# Altium schematic sheet FPGA_165B_StopWatch.SchDoc: LiveDesign Evaluation - Stop Watch
size A3; Organization: Altium Limited; Address1: L3, 12a Rodborough Rd; Address2: Frenchs Forest; Address3: NSW; Address4: Australia 2086; DocumentNumber: 1; SheetNumber: 1; SheetTotal: 7
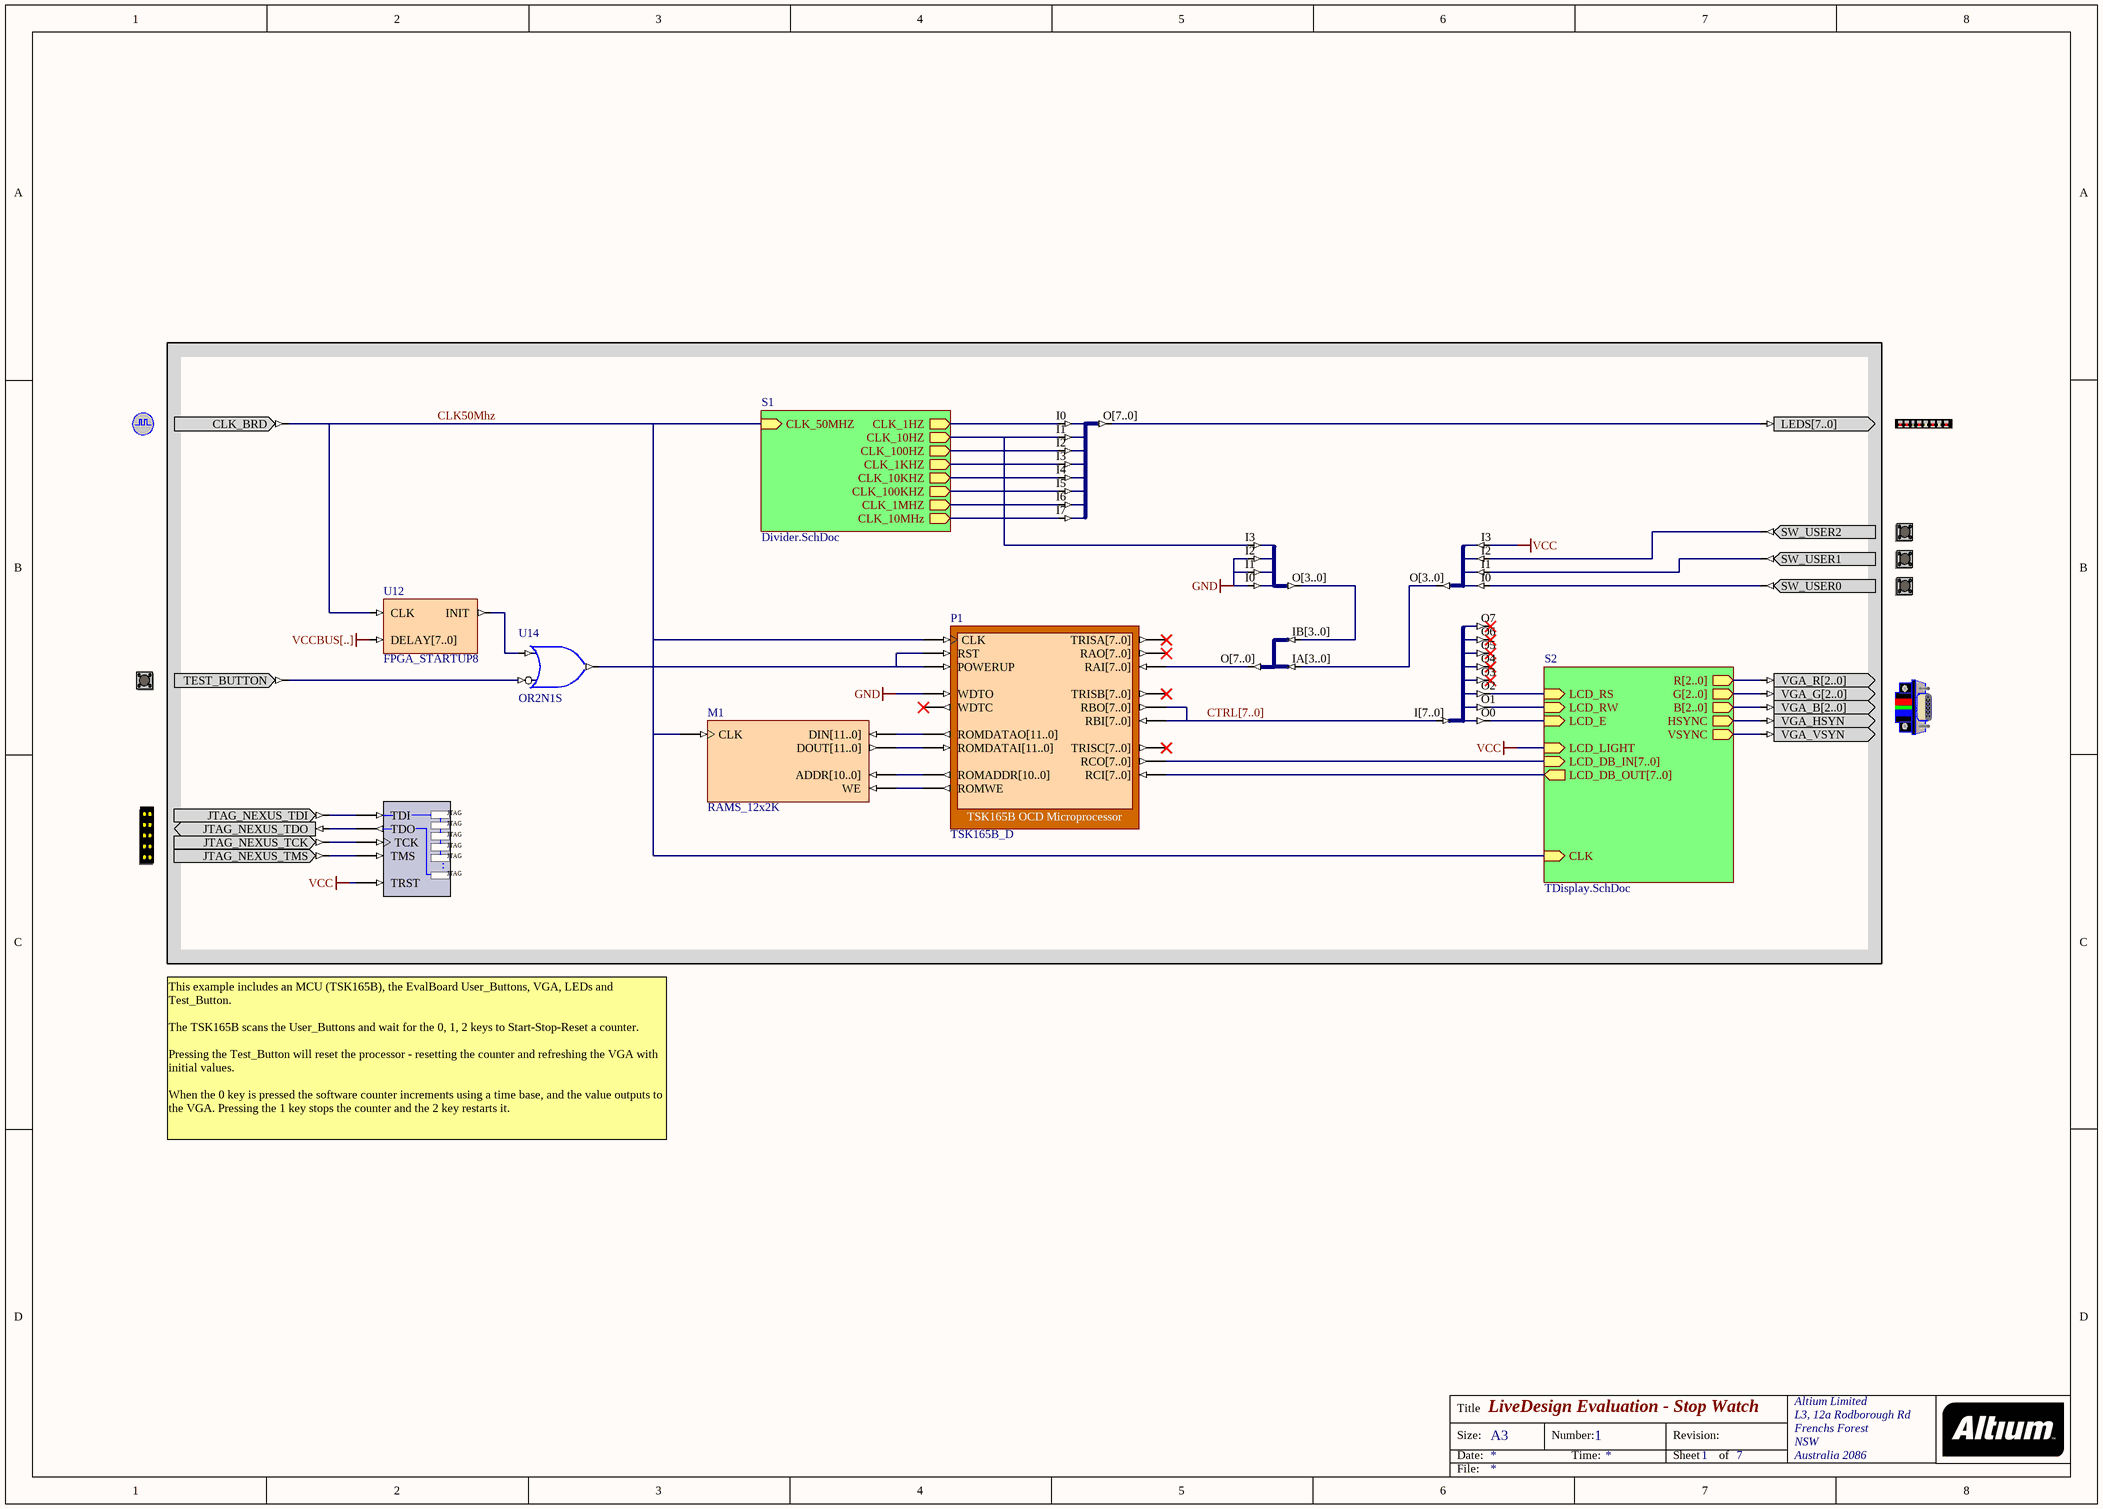
[diagram p0: FPGA_165B_StopWatch.SchDoc]

## Parts
CLOCK_BOARD  CLOCK_BOARD  (value not drawn)
LED  LED  (value not drawn)
M1  RAMS_12x2K
NEXUS_JTAG_CONNECTOR  NEXUS_JTAG_CONNECTOR  (value not drawn)
NEXUS_JTAG_PORT  NEXUS_JTAG_PORT  (value not drawn)
P1  TSK165B_D
TEST_BUTTON  TEST_BUTTON  (value not drawn)
U9  J8S_8B  (value not drawn)
U10  J4S_4B  (value not drawn)
U11  J4S_4B  (value not drawn)
U12  FPGA_STARTUP8
U13  J8B_8S  (value not drawn)
U14  OR2N1S
U15  J4B2_8B  (value not drawn)
USER_BUTTON0  USER_BUTTON0  (value not drawn)
USER_BUTTON1  USER_BUTTON1  (value not drawn)
USER_BUTTON2  USER_BUTTON2  (value not drawn)
VGACNTR  VGACNTR  (value not drawn)

## Sub-sheets
S1 = Divider.SchDoc: CLK_50MHZ (in), CLK_10HZ (out), CLK_100HZ (out), CLK_1KHZ (out), CLK_10KHZ (out), CLK_100KHZ (out), CLK_1MHZ (out), CLK_1HZ (out), CLK_10MHz (out)
S2 = TDisplay.SchDoc: CLK (in), HSYNC (out), VSYNC (out), R[2..0] (out), G[2..0] (out), B[2..0] (out), LCD_LIGHT (in), LCD_E (in), LCD_RW (in), LCD_RS (in), LCD_DB_IN[7..0] (in), LCD_DB_OUT[7..0] (out)

## Nets
GND: P1.WDTO U11.I0 U11.I1 U11.I2
VCC: NEXUS_JTAG_PORT.TRST U10.I3 ; sheet S2/LCD_LIGHT
VCCBUS[..]: U12.DELAY[7..0]
CLK50Mhz: CLOCK_BOARD.CLK_BRD M1.CLK P1.CLK U12.CLK ; sheet S1/CLK_50MHZ, sheet S2/CLK
CTRL[7..0]: P1.RBI[7..0] P1.RBO[7..0] U13.I[7..0]
NetLED_LEDS[7..0]: LED.LEDS[7..0] U9.O[7..0]
NetM1_ADDR[10..0]: M1.ADDR[10..0] P1.ROMADDR[10..0]
NetM1_DIN[11..0]: M1.DIN[11..0] P1.ROMDATAO[11..0]
NetM1_DOUT[11..0]: M1.DOUT[11..0] P1.ROMDATAI[11..0]
NetM1_WE: M1.WE P1.ROMWE
NetNEXUS_JTAG_CONNECTOR_JTAG_NEXUS_TCK: NEXUS_JTAG_CONNECTOR.JTAG_NEXUS_TCK NEXUS_JTAG_PORT.TCK
NetNEXUS_JTAG_CONNECTOR_JTAG_NEXUS_TDI: NEXUS_JTAG_CONNECTOR.JTAG_NEXUS_TDI NEXUS_JTAG_PORT.TDI
NetNEXUS_JTAG_CONNECTOR_JTAG_NEXUS_TDO: NEXUS_JTAG_CONNECTOR.JTAG_NEXUS_TDO NEXUS_JTAG_PORT.TDO
NetNEXUS_JTAG_CONNECTOR_JTAG_NEXUS_TMS: NEXUS_JTAG_CONNECTOR.JTAG_NEXUS_TMS NEXUS_JTAG_PORT.TMS
NetP1_POWERUP: P1.POWERUP P1.RST U14.O
NetP1_RAI[7..0]: P1.RAI[7..0] U15.O[7..0]
NetP1_RCI[7..0]: P1.RCI[7..0] ; sheet S2/LCD_DB_OUT[7..0]
NetP1_RCO[7..0]: P1.RCO[7..0] ; sheet S2/LCD_DB_IN[7..0]
NetTEST_BUTTON_TEST_BUTTON: TEST_BUTTON.TEST_BUTTON U14.I0
NetU9_I0: U9.I0 ; sheet S1/CLK_1HZ
NetU9_I1: U9.I1 U11.I3 ; sheet S1/CLK_10HZ
NetU9_I2: U9.I2 ; sheet S1/CLK_100HZ
NetU9_I3: U9.I3 ; sheet S1/CLK_1KHZ
NetU9_I4: U9.I4 ; sheet S1/CLK_10KHZ
NetU9_I5: U9.I5 ; sheet S1/CLK_100KHZ
NetU9_I6: U9.I6 ; sheet S1/CLK_1MHZ
NetU9_I7: U9.I7 ; sheet S1/CLK_10MHz
NetU10_I0: U10.I0 USER_BUTTON0.SW_USER0
NetU10_I1: U10.I1 USER_BUTTON1.SW_USER1
NetU10_I2: U10.I2 USER_BUTTON2.SW_USER2
NetU10_O[3..0]: U10.O[3..0] U15.IA[3..0]
NetU11_O[3..0]: U11.O[3..0] U15.IB[3..0]
NetU12_INIT: U12.INIT U14.I1
NetU13_O0: U13.O0 ; sheet S2/LCD_E
NetU13_O1: U13.O1 ; sheet S2/LCD_RW
NetU13_O2: U13.O2 ; sheet S2/LCD_RS
NetVGACNTR_VGA_B[2..0]: VGACNTR.VGA_B[2..0] ; sheet S2/B[2..0]
NetVGACNTR_VGA_G[2..0]: VGACNTR.VGA_G[2..0] ; sheet S2/G[2..0]
NetVGACNTR_VGA_HSYN: VGACNTR.VGA_HSYN ; sheet S2/HSYNC
NetVGACNTR_VGA_R[2..0]: VGACNTR.VGA_R[2..0] ; sheet S2/R[2..0]
NetVGACNTR_VGA_VSYN: VGACNTR.VGA_VSYN ; sheet S2/VSYNC

Not connected (* = marked no-connect by the designer): P1 RAO[7..0]* TRISA[7..0]* TRISB[7..0]* TRISC[7..0]* WDTC*; U13 O3* O4* O5* O6* O7*

## Buses and harness runs
bus CTRL[7..0]

## Notes on the sheet
- This example includes an MCU (TSK165B), the EvalBoard User_Buttons, VGA, LEDs and Test_Button.
  The TSK165B scans the User_Buttons and wait for the 0, 1, 2 keys to Start-Stop-Reset a counter.
  Pressing the Test_Button will reset the processor - resetting the counter and refreshing the VGA with initial values.
  When the 0 key is pressed the software counter increments using a time base, and the value outputs to the VGA. Pressing the 1 key stops the counter and the 2 key restarts it.
- Title
- Size:
- Date:
- A3
- Number:
- Time:
- Revision:
- Sheet
- of
- File:
- (in symbol NEXUS_JTAG_PORT) JTAG; .

## Library data of the parts
CLOCK_BOARD = CLOCK_BOARD: Global System Clock Supply; PortComponent: True; Published: 19-Nov-2003; Publisher: Altium Limited
LED = LED: 8-Way LEDS; PortComponent: True; Published: 19-Nov-2003; Publisher: Altium Limited
M1 = RAMS_12x2K: Single Port RAM; Memory_Depth: 2048; Memory_Type: RAM_SinglePortBlock; Memory_Width: 12; Memory_ClockEdge: Rising; Nexus_Core: Memory_Program; Memory_EnablePin: False; Published: 23/04/2004; Publisher: Altium Hobart Technology Center
NEXUS_JTAG_CONNECTOR = NEXUS_JTAG_CONNECTOR: JTAG Port; PortComponent: True; Published: 19-Nov-2003; Publisher: Altium Limited
NEXUS_JTAG_PORT = NEXUS_JTAG_PORT: Soft Nexus-Chain Connector; NEXUS_JTAG_CONNECTOR: True; Published: 18-Dec-2003; Publisher: Altium Limited
P1 = TSK165B_D: TSK165B OCD Microprocessor; NEXUS_CORE: Processor_OCDS; NEXUS_JTAG_DEVICE: True; NEXUS_JTAG_ORDER: 0; ChildModel1: TSK165B_D_RAM128x8; ChildCore1: M1; Published: 18/12/2003; Publisher: Altium Hobart Technology Centre; Core Revision: 1.00.00
TEST_BUTTON = TEST_BUTTON: Test Button; PortComponent: True; Published: 19-Nov-2003; Publisher: Altium Limited
U9 = J8S_8B: 8 Single pin inputs to single 8-Bit output bus; ArchiveName: GENERIC; VHDLIB_SIM: GENERIC_LIB; Published: 29-Jan-2004; Publisher: Altium Limited; Core Revision: 1.00.00
U10 U11 = J4S_4B: 4 Single pin inputs to single 4-Bit output bus; ArchiveName: GENERIC; VHDLIB_SIM: GENERIC_LIB; Published: 29-Jan-2004; Publisher: Altium Limited; Core Revision: 1.00.00
U12 = FPGA_STARTUP8: FPGA Startup With 8 Bit Delay; Published: 21/01/2004; Publisher: Altium Hobart Technology Centre; Core Revision: 1.00.00
U13 = J8B_8S: 8-Bit input bus to 8 single pin outputs; ArchiveName: GENERIC; VHDLIB_SIM: GENERIC_LIB; Published: 29-Jan-2004; Publisher: Altium Limited; Core Revision: 1.00.00
U14 = OR2N1S: 2-Input OR Gate with Active Low A Input, Single Pin Version; Xilinx Equivalent: OR2B1; ArchiveName: GENERIC; VHDLIB_SIM: GENERIC_LIB; Published: 29-Jan-2004; Publisher: Altium Limited; Core Revision: 1.00.00
U15 = J4B2_8B: 2 x 4-Bit input bus to 1 x 8-bit output bus; ArchiveName: GENERIC; VHDLIB_SIM: GENERIC_LIB; Published: 29-Jan-2004; Publisher: Altium Limited; Core Revision: 1.00.00
USER_BUTTON0 = USER_BUTTON0: User Buttons; PortComponent: True; Published: 19-Nov-2003; Publisher: Altium Limited
USER_BUTTON1 = USER_BUTTON1: User Buttons; PortComponent: True; Published: 19-Nov-2003; Publisher: Altium Limited
USER_BUTTON2 = USER_BUTTON2: User Buttons; PortComponent: True; Published: 19-Nov-2003; Publisher: Altium Limited
VGACNTR = VGACNTR: VGA Dsub-15-Female-HD; PortComponent: True; Published: 19-Nov-2003; Publisher: Altium Limited